# Altium schematic sheet 1_P1.schdoc.schdoc
size 220 x 160 mm; Symbol: Sheet-Symbol_A4; Device: Sheet-Symbol_A4; Company: 嘉立创EDA; Version: V1.0; Page Size: A5; @Project Name: 2024毕设; @Page Count: 1; @Update Date: 2024-05-12; @Create Date: 2024-05-12; @Schematic Name: 水位传感; @Page No: 1; @Page Name: P1.水位传感
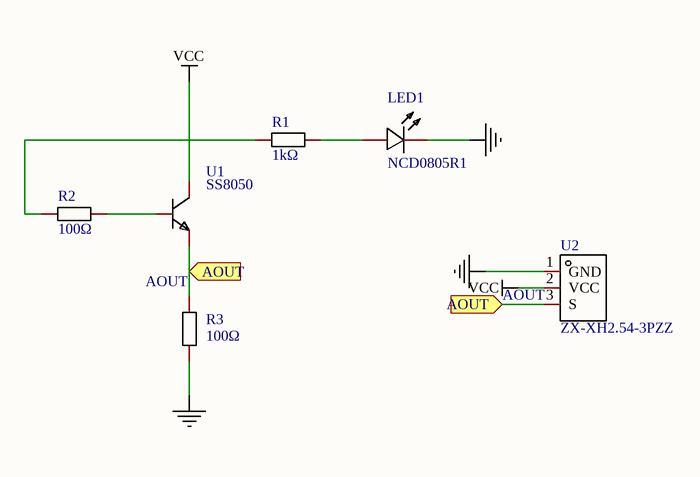
[diagram p0: 1_P1.schdoc.schdoc]

## Parts
LED1  NCD0805R1  [LED0805-R-RD]
R1  1kΩ  [R0805]
R2  100Ω  [R0805]
R3  100Ω  [R0805]
U1  SS8050  [SOT-23-3_L2.9-W1.3-P1.90-LS2.4-BR]
U2  ZX-XH2.54-3PZZ  [CONN-TH_3P-P2.54_2501S-3P]

## Ports
AOUT (in)

## Nets
NetLED1_2: LED1.2(-) R3.1 U2.1(GND)
VCC: R1.1 R2.2 U1.3(C) U2.2(VCC)
AOUT: R3.2 U1.2(E) U2.3(S) ; port AOUT
NetLED1_1: LED1.1(+) R1.2
NetR2_1: R2.1 U1.1(B)

## Notes on the sheet
- 1
- 2
- 3
- 4
- 5
- 6
- A
- B
- C
- 原理图
- 水位传感
- 创建日期
- 更新日期
- 2024-05-12
- 审阅
- 绘制
- 图页
- P1.水位传感
- 物料编码
- 2024毕设
- D
- 版本
- 尺寸
- 页
- 共
- V1.0
- A5
- 嘉立创EDA

## Library data of the parts
LED1 = NCD0805R1: Manufacturer: 国星光电; Symbol: FC-2012HRK-620D; Add into BOM: yes; Emitted Color: 红色; Forward Voltage (VF): 1.6V~2.6V; Power Dissipation: 65mW; Forward Current: 20mA; Dominant Wavelength: 615nm~630nm; Diode Configuration: 独立二极管; Lens Color: 无色透明透镜; Luminous Intensity: 67mcd~195mcd; Viewing Angle: 130°; Description: 灯头类型:-;发光颜色:红色;正向电压(VF):1.6V~2.6V;功率:65mW;正向电流:20mA;主波长:615nm~630nm;二极管配置:独立二极管;透镜颜色:无色透明透镜;色温:-;发光强度:67mcd~195mcd;发光角度:130°;载带方式:-;工作温度:-30℃~+85℃;; Name: NCD0805R1; Device: NCD0805R1; Supplier: LCSC; Manufacturer Part: NCD0805R1; Supplier Part: C84256; JLCPCB Part Class: 基础库; LCSC Part Name: NCD0805R1; Supplier Footprint: 0805; Datasheet: https://atta.szlcsc.com/upload/public/pdf/source/20200820/C84256_F0A75A43B3EAD75808600A0514C76B99.pdf; Convert to PCB: yes; Lamp Holder Type: -; Peak Wavelength: -; Color Temperature: -; Mounting Sytle: -; Operating Temperature: -30℃~+85℃
R1 = 0805W8F1001T5E: Manufacturer: UNI-ROYAL(厚声); Add into BOM: yes; Tolerance: ±1%; Power(Watts): 125mW; Overload Voltage (Max): 150V; Temperature Coefficient: ±100ppm/℃; Description: 电阻类型:厚膜电阻;阻值:1kΩ;精度:±1%;功率:125mW;最大工作电压:150V;温度系数:±100ppm/℃;; Name: 1kΩ; Symbol: 0805W8F1001T5E; Device: 0805W8F1001T5E; LCSC Part Name: 1kΩ ±1% 125mW 厚膜电阻; Supplier Part: C17513; Manufacturer Part: 0805W8F1001T5E; Supplier Footprint: 0805; JLCPCB Part Class: 基础库; Datasheet: https://atta.szlcsc.com/upload/public/pdf/source/20200306/C422600_1E6D84923E4A46A82E41ADD87F860B5C.pdf; Supplier: LCSC; Convert to PCB: yes; Type: 厚膜电阻; Value: 1kΩ; Operating Temperature Range: -55℃~+155℃
R2 R3 = 0805W8F1000T5E: Manufacturer: UNI-ROYAL(厚声); Add into BOM: yes; Tolerance: ±1%; Power(Watts): 125mW; Overload Voltage (Max): 150V; Temperature Coefficient: ±100ppm/℃; Description: 电阻类型:厚膜电阻;阻值:100Ω;精度:±1%;功率:125mW;最大工作电压:150V;温度系数:±100ppm/℃;; Name: 100Ω; Symbol: 0805W8F1000T5E; Device: 0805W8F1000T5E; LCSC Part Name: 100Ω ±1% 125mW 厚膜电阻; Supplier Part: C17408; Manufacturer Part: 0805W8F1000T5E; Supplier Footprint: 0805; JLCPCB Part Class: 基础库; Datasheet: https://atta.szlcsc.com/upload/public/pdf/source/20200306/C422600_1E6D84923E4A46A82E41ADD87F860B5C.pdf; Supplier: LCSC; Convert to PCB: yes; Type: 厚膜电阻; Value: 100Ω; Operating Temperature Range: -55℃~+155℃
U1 = SS8050_C7420370: Manufacturer: 宏迦橙; Add into BOM: yes; Transistor Type: NPN; Collector Current (Ic): 1.5A; Collector-Emitter Breakdown Voltage (Vceo): 25V; Power Dissipation (Pd): 300mW; DC Current Gain (hFE@Ic,Vce): 120@100mA,1.0V; Transition Frequency (fT): 100MHz; Collector Cut-Off Current (Icbo): 100nA; Collector-Emitter Saturation Voltage (VCE(sat)@Ic,Ib): 500mV@800mA,80mA; Description: 晶体管类型:NPN;集电极电流(Ic):1.5A;集射极击穿电压(Vceo):25V;功率(Pd):300mW;直流电流增益(hFE@Ic,Vce):120@100mA,1.0V;; Name: SS8050; Symbol: SS8050_C7420370; Device: SS8050_C7420370; Supplier: LCSC; Supplier Part: C7420370; Manufacturer Part: SS8050; JLCPCB Part Class: 扩展库; LCSC Part Name: 耐压:25V 电流:1.5A NPN H档 200-350; Supplier Footprint: SOT-23; Datasheet: https://atta.szlcsc.com/upload/public/pdf/source/20231222/9C4050A7669EB24B3ACD0418218817FD.pdf; Convert to PCB: yes; Operating Temperature: -55℃~+150℃
U2 = 水位传感器: Manufacturer: Megastar(兆星); Add into BOM: yes; Pins Structure: 1x3P; Pitch: 2.54mm; Reference Series: XH; Number of PINs Per Row: 3; Current Rating (Max): 3A; Description: 插针结构:1x3P;间距:2.54mm;安装方式:直插;参考系列:XH;总PIN数:3P;排数:1;每排PIN数:3;行距:-;额定电流:3A;触头材质:黄铜;触头镀层:锡;工作温度范围:-25℃~+85℃;; Name: ZX-XH2.54-3PZZ; Symbol: 水位传感器; Device: 水位传感器; Supplier: LCSC; Supplier Part: C7429633; Manufacturer Part: ZX-XH2.54-3PZZ; JLCPCB Part Class: 扩展库; LCSC Part Name: ZX-XH2.54-3PZZ; Supplier Footprint: 插件,P=2.54mm; Datasheet: https://atta.szlcsc.com/upload/public/pdf/source/20230619/AE17037A2CFDBE8D9CBA775D61AD0A84.pdf; Convert to PCB: yes; Mounting Style: 直插; Number of Pins: 3P; Number of Rows: 1; Row Spacing: -; Contact Material: 黄铜; Contact Plating: 锡; Operating Temperature Range: -25℃~+85℃